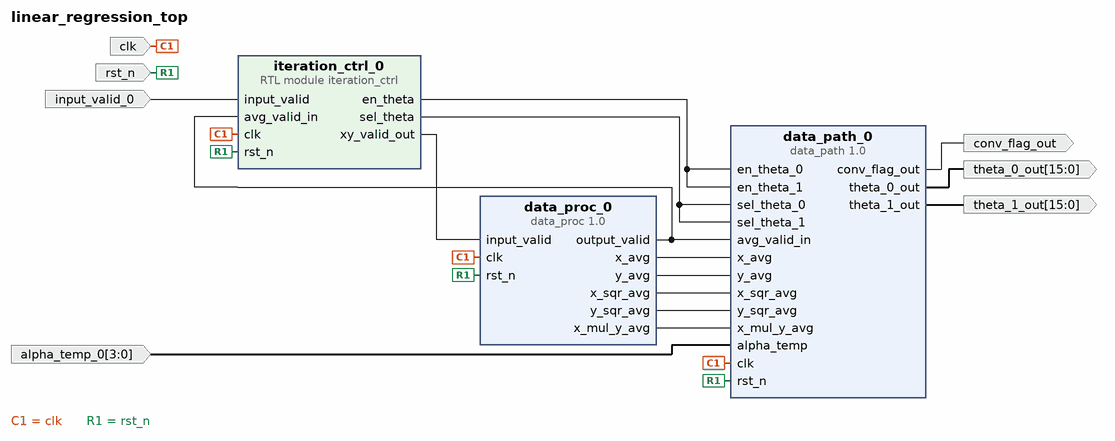
[diagram p0: block diagram of the top level]
# Vivado block design linear_regression_top, xc7vx415tffg1157-1, Vivado 2018.3
create_bd_design linear_regression_top

create_bd_port -dir I -type clk clk
create_bd_port -dir I -type rst rst_n
create_bd_port -dir I -from 3 -to 0 alpha_temp_0
create_bd_port -dir I input_valid_0
create_bd_port -dir O conv_flag_out
create_bd_port -dir O -from 15 -to 0 theta_0_out
create_bd_port -dir O -from 15 -to 0 theta_1_out

create_bd_cell -type ip -vlnv xilinx.com:user:data_proc:1.0 data_proc_0
create_bd_cell -type ip -vlnv xilinx.com:user:data_path:1.0 data_path_0
create_bd_cell -type module -reference iteration_ctrl iteration_ctrl_0

# ---- connections ----

connect_bd_net -net clk_0_1 [get_bd_ports clk] [get_bd_pins data_proc_0/clk] [get_bd_pins data_path_0/clk] [get_bd_pins iteration_ctrl_0/clk]
connect_bd_net -net rst_n_0_1 [get_bd_ports rst_n] \
  [get_bd_pins data_proc_0/rst_n] [get_bd_pins data_path_0/rst_n] [get_bd_pins iteration_ctrl_0/rst_n]
connect_bd_net [get_bd_pins iteration_ctrl_0/xy_valid_out] [get_bd_pins data_proc_0/input_valid]
connect_bd_net [get_bd_pins iteration_ctrl_0/en_theta] [get_bd_pins data_path_0/en_theta_0] [get_bd_pins data_path_0/en_theta_1]
connect_bd_net [get_bd_pins iteration_ctrl_0/sel_theta] [get_bd_pins data_path_0/sel_theta_0] [get_bd_pins data_path_0/sel_theta_1]
connect_bd_net [get_bd_pins data_proc_0/output_valid] [get_bd_pins iteration_ctrl_0/avg_valid_in] [get_bd_pins data_path_0/avg_valid_in]
connect_bd_net [get_bd_pins data_proc_0/x_avg] [get_bd_pins data_path_0/x_avg]
connect_bd_net [get_bd_pins data_proc_0/y_avg] [get_bd_pins data_path_0/y_avg]
connect_bd_net [get_bd_pins data_proc_0/x_sqr_avg] [get_bd_pins data_path_0/x_sqr_avg]
connect_bd_net [get_bd_pins data_proc_0/y_sqr_avg] [get_bd_pins data_path_0/y_sqr_avg]
connect_bd_net [get_bd_pins data_proc_0/x_mul_y_avg] [get_bd_pins data_path_0/x_mul_y_avg]
connect_bd_net -net alpha_temp_0_1 [get_bd_ports alpha_temp_0] [get_bd_pins data_path_0/alpha_temp]
connect_bd_net -net input_valid_0_1 [get_bd_ports input_valid_0] [get_bd_pins iteration_ctrl_0/input_valid]
connect_bd_net [get_bd_pins data_path_0/conv_flag_out] [get_bd_ports conv_flag_out]
connect_bd_net [get_bd_pins data_path_0/theta_0_out] [get_bd_ports theta_0_out]
connect_bd_net [get_bd_pins data_path_0/theta_1_out] [get_bd_ports theta_1_out]

validate_bd_design
save_bd_design
